# EAGLE design ptFlex (EAGLE 6.6.0)
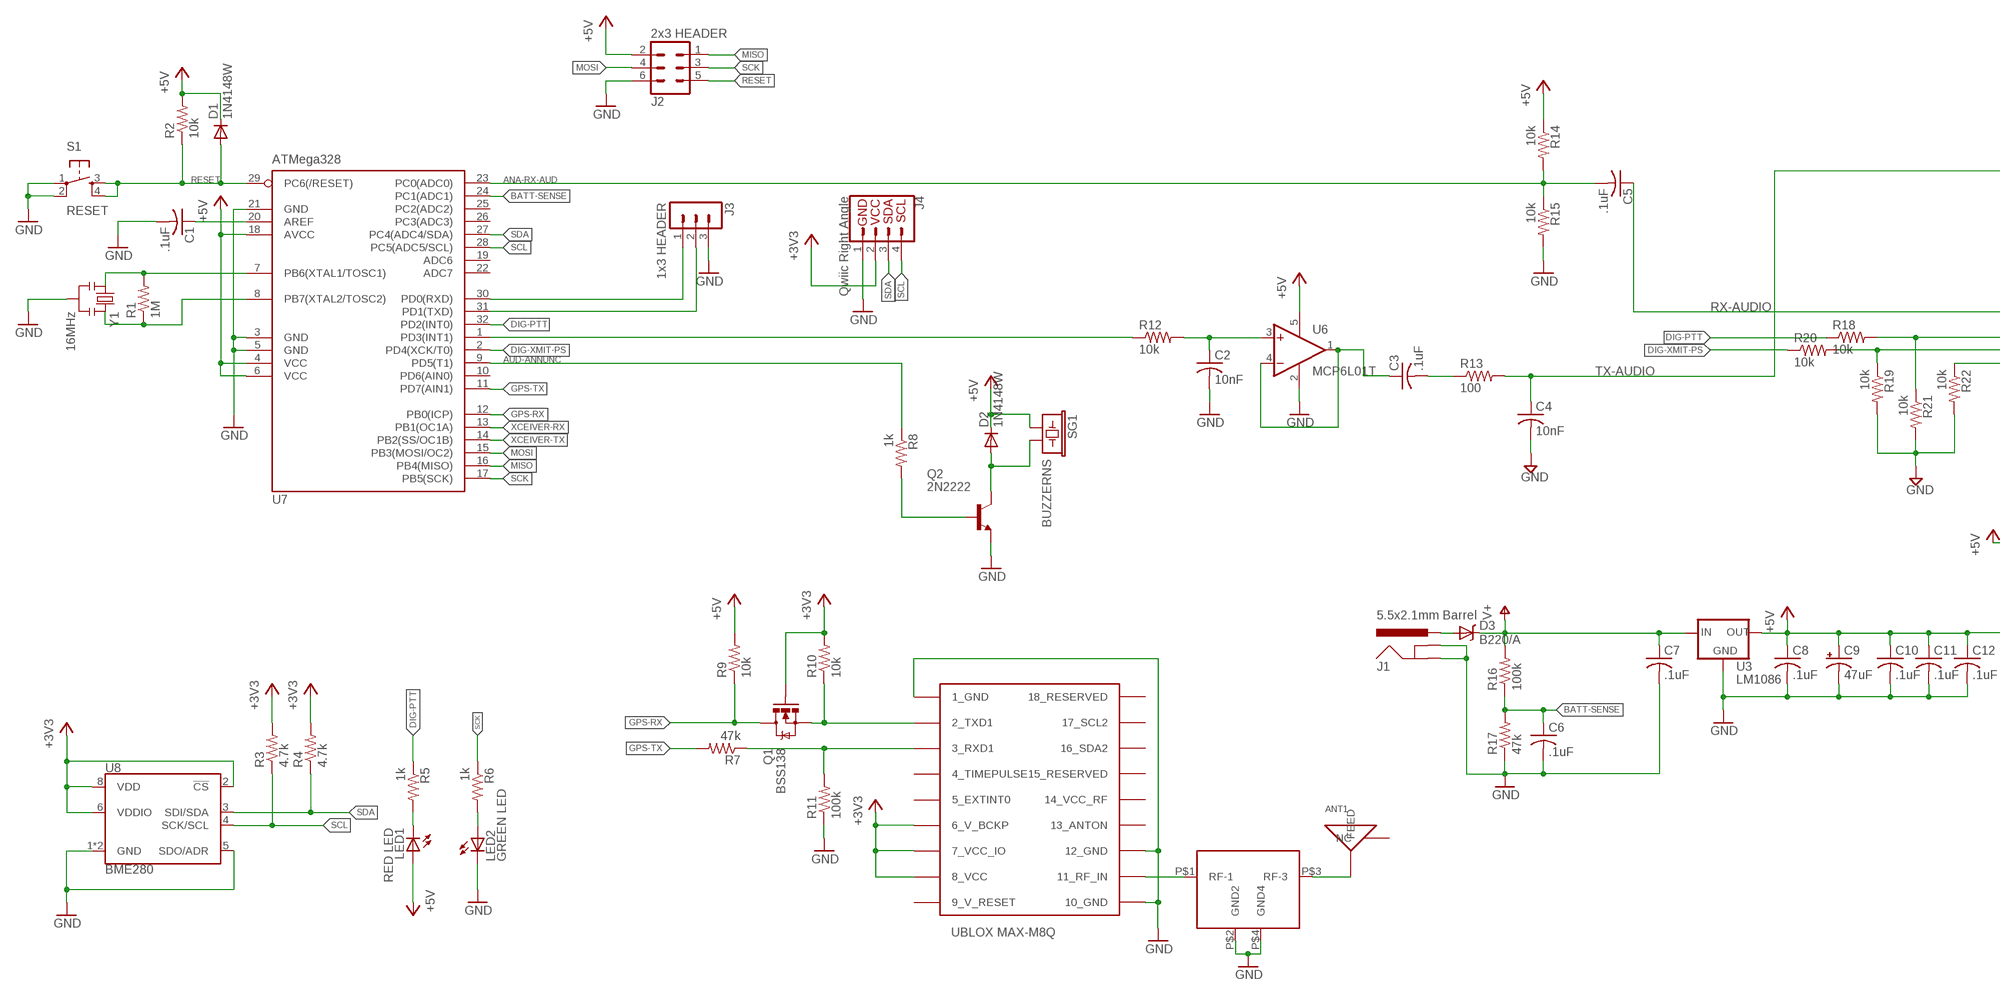
[diagram p0: schematic, sheet 1, part 1 of 2]
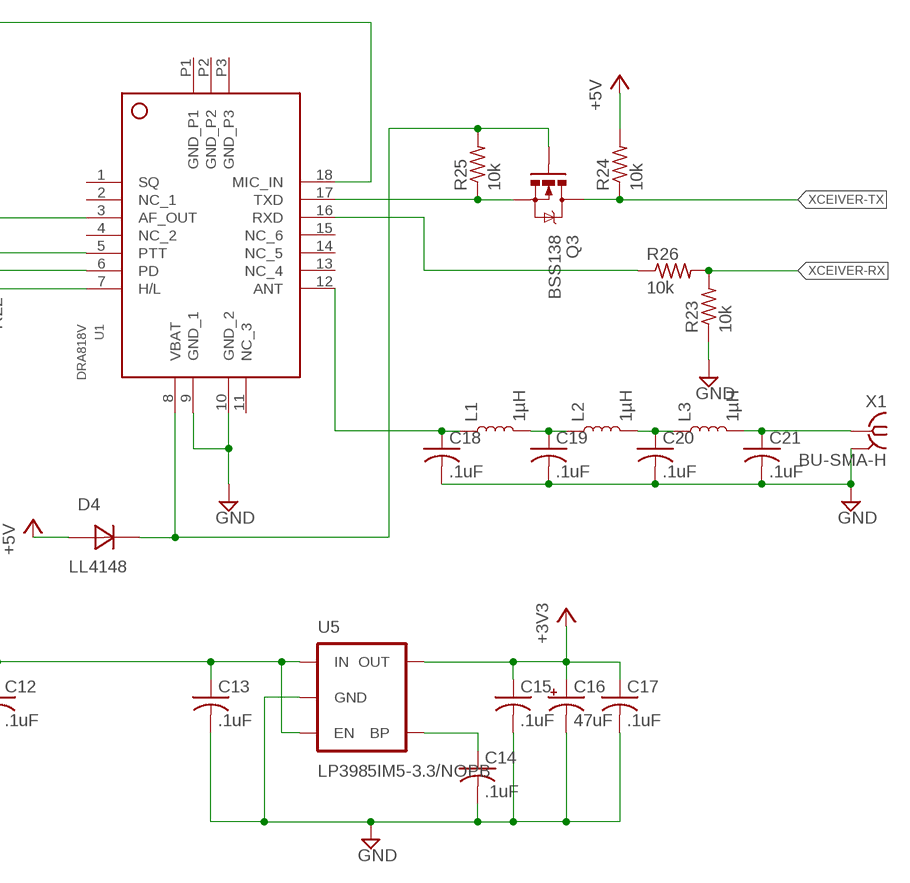
[diagram p1: schematic, sheet 1, part 2 of 2]

## Parts
ANT1  GPS ANTENNA  GPS_ANT_SMDBAR  [1575AT43A40]
C1  .1uF  C-USC0805  [C0805]
C2  10nF  C-USC0805  [C0805]
C3  .1uF  C-USC0805  [C0805]
C4  10nF  C-USC0805  [C0805]
C5  .1uF  C-USC0805  [C0805]
C6  .1uF  C-USC0805  [C0805]
C7  .1uF  C-USC0805  [C0805]
C8  .1uF  C-USC0805  [C0805]
C9  47uF  CPOL-US153CLV-0605  [153CLV-0605]
C10  .1uF  C-USC0805  [C0805]
C11  .1uF  C-USC0805  [C0805]
C12  .1uF  C-USC0805  [C0805]
C13  .1uF  C-USC0805  [C0805]
C14  .1uF  C-USC0805  [C0805]
C15  .1uF  C-USC0805  [C0805]
C16  47uF  CPOL-US153CLV-0605  [153CLV-0605]
C17  .1uF  C-USC0805  [C0805]
C18  .1uF  C-USC0805  [C0805]
C19  .1uF  C-USC0805  [C0805]
C20  .1uF  C-USC0805  [C0805]
C21  .1uF  C-USC0805  [C0805]
D1  1N4148W  DIODE-SOD123  [SOD123]
D2  1N4148W  DIODE-SOD123  [SOD123]
D3  B220/A  B340A  [SMA-DIODE]
D4  LL4148  [SOD-80]
F1  MURATA-GPS-FILTER  [MURATA-GPS-FILTER]
J1  5.5x2.1mm Barrel  POWER_JACKSMD  [POWER_JACK_SMD]
J2  2x3 HEADER  MA03-2  [MA03-2]
J3  1x3 HEADER  MA03-1  [MA03-1]
J4  Qwiic Right Angle  I2C_STANDARDQWIIC  [1X04_1MM_RA]
L1  1µH  INDUCTOR  [L0805]
L2  1µH  INDUCTOR  [L0805]
L3  1µH  INDUCTOR  [L0805]
LED1  RED LED  LEDCHIPLED_1206  [CHIPLED_1206]
LED2  GREEN LED  LEDCHIPLED_1206  [CHIPLED_1206]
Q1  BSS138  MOSFET-NCHANNELBSS138  [SOT23]
Q2  2N2222  BC817-16LT1SMD  [SOT23-BEC]
Q3  BSS138  MOSFET-NCHANNELBSS138  [SOT23]
R1  1M  R-US_R0805  [R0805]
R2  10k  R-US_R0805  [R0805]
R3  4.7k  R-US_R0805  [R0805]
R4  4.7k  R-US_R0805  [R0805]
R5  1k  R-US_R0805  [R0805]
R6  1k  R-US_R0805  [R0805]
R7  47k  R-US_R0805  [R0805]
R8  1k  R-US_R0805  [R0805]
R9  10k  R-US_R0805  [R0805]
R10  10k  R-US_R0805  [R0805]
R11  100k  R-US_R0805  [R0805]
R12  10k  R-US_R0805  [R0805]
R13  100  R-US_R0805  [R0805]
R14  10k  R-US_R0805  [R0805]
R15  10k  R-US_R0805  [R0805]
R16  100k  R-US_R0805  [R0805]
R17  47k  R-US_R0805  [R0805]
R18  10k  R-US_R0805  [R0805]
R19  10k  R-US_R0805  [R0805]
R20  10k  R-US_R0805  [R0805]
R21  10k  R-US_R0805  [R0805]
R22  10k  R-US_R0805  [R0805]
R23  10k  R-US_R0805  [R0805]
R24  10k  R-US_R0805  [R0805]
R25  10k  R-US_R0805  [R0805]
R26  10k  R-US_R0805  [R0805]
S1  RESET  TAC_SWITCHSMD  [TACTILE_SWITCH_SMD]
SG1  BUZZERNS  [BUZZER-12MM-NS]
U1  DRA818V  [SMD_DRA818]
U2  UBLOX_MAX  [UBLOX_MAX]
U3  LM1086  LM1086TO263  [TO263]
U5  LP3985IM5-3.3/NOPB  V_REG_LDOSMD  [SOT23-5]
U6  MCP6L01T  OPA725DBV  [SOT23-5]
U7  ATMega328  MEGA8-AI  [TQFP32-08]
U8  BME280  [LGA-8-2.5X2.5]
X1  BU-SMA-H  [BU-SMA-H]
Y1  16MHz  RESONATOR16MHZ  [RESONATOR-SMD]

## Nets
+3V3: C15.1 C16.+ C17.1 J4.2 Q1.1(G) R3.2 R4.2 R10.2 U2.6_V_BCKP U2.7_VCC_IO U2.8_VCC U5.5(OUT) U8.2(!CS) U8.6(VDDIO) U8.8(VDD)
+5V [Power]: C8.1 C9.+ C10.1 C11.1 C12.1 C13.1 D1.C D2.C D4.ANODE J2.2 LED1.A R2.2 R9.2 R14.1 R24.2 SG1.+ U3.2(OUT) U5.1(IN) U5.3(EN) U6.5(V+) U7.4(VCC) U7.6(VCC) U7.18(AVCC)
ANA-RX-AUD: C5.2 R14.2 R15.1 U7.23(PC0(ADC0))
AUD-ANNUNC: R8.1 U7.9(PD5(T1))
BATT-SENSE: C6.1 R16.1 R17.2 U7.24(PC1(ADC1))
DIG-PTT: R5.1 R18.1 U7.32(PD2(INT0))
DIG-XMIT-PS: R20.1 U7.2(PD4(XCK/T0))
GND [Power]: C1.2 C2.2 C4.2 C6.2 C7.2 C8.2 C9.- C10.2 C11.2 C12.2 C13.2 C14.2 C15.2 C16.- C17.2 C18.2 C19.2 C20.2 C21.2 F1.P$2(GND2) F1.P$4(GND4) J1.GND(GNDBREAK) J1.P$4(GND) J2.6 J3.3 J4.1 LED2.C Q2.E R11.1 R15.2 R17.1 R19.2 R21.2 R22.2 R23.1 S1.1 S1.2 U1.9(GND_1) U1.10(GND_2) U2.1_GND U2.10_GND U2.12_GND U3.1(GND) U5.2(GND) U6.2(V-) U7.3(GND) U7.5(GND) U7.21(GND) U8.1(GND) U8.5(SDO/ADR) U8.7(GND) X1.2 X1.3 X1.4 X1.5 Y1.2
GPS-RX: Q1.3(D) R9.1 U7.12(PB0(ICP))
GPS-TX: R7.2 U7.11(PD7(AIN1))
MISO: J2.1 U7.16(PB4(MISO))
MOSI: J2.4 U7.15(PB3(MOSI/OC2))
N$1: C2.1 R12.2 U6.3(+IN)
N$2: F1.P$1(RF-1) U2.11_RF_IN
N$3: ANT1.FEED F1.P$3(RF-3)
N$4: C20.1 L2.2 L3.1
N$5: C19.1 L1.2 L2.1
N$6: C18.1 L1.1 U1.12(ANT)
N$7: C21.1 L3.2 X1.1
N$8: D3.A J1.VIN0(PWR)
N$9: D2.A Q2.C SG1.-
N$10: C4.1 R13.2 U1.18(MIC_IN)
N$11: C3.1 U6.1(OUT) U6.4(-IN)
N$12: D4.CATHODE Q3.1(G) R25.2 U1.8(VBAT)
N$13: R12.1 U7.1(PD3(INT1))
N$14: R18.2 R21.1 U1.5(PTT)
N$15: Q1.2(S) R10.1 U2.2_TXD1
N$16: R19.1 R20.2 U1.6(PD)
N$17: R1.1 U7.8(PB7(XTAL2/TOSC2)) Y1.3
N$18: R7.1 R11.2 U2.3_RXD1
N$19: R22.1 U1.7(H/L)
N$20: Q3.2(S) R25.1 U1.17(TXD)
N$21: LED1.C R5.2
N$25: LED2.A R6.2
N$27: Q2.B R8.2
N$28: R26.1 U1.16(RXD)
N$59: C1.1 U7.20(AREF)
N$60: C14.1 U5.4(BP)
N$64: R1.2 U7.7(PB6(XTAL1/TOSC1)) Y1.1
RESET: D1.A J2.5 R2.1 S1.3 S1.4 U7.29(PC6(/RESET))
RX-AUDIO: C5.1 U1.3(AF_OUT)
RXD: J3.1 U7.30(PD0(RXD))
SCK: J2.3 R6.1 U7.17(PB5(SCK))
SCL: J4.4 R3.1 U7.28(PC5(ADC5/SCL)) U8.4(SCK/SCL)
SDA: J4.3 R4.1 U7.27(PC4(ADC4/SDA)) U8.3(SDI/SDA)
TX-AUDIO: C3.2 R13.1
TXD: J3.2 U7.31(PD1(TXD))
V+ [Power]: C7.1 D3.C R16.2 U3.3(IN)
XCEIVER-RX: R23.2 R26.2 U7.13(PB1(OC1A))
XCEIVER-TX: Q3.3(D) R24.1 U7.14(PB2(SS/OC1B))
Unconnected: ANT1.NC U1.1(SQ) U1.2(NC_1) U1.4(NC_2) U1.11(NC_3) U1.13(NC_4) U1.14(NC_5) U1.15(NC_6) U1.P1(GND_P1) U1.P2(GND_P2) U1.P3(GND_P3) U2.4_TIMEPULSE U2.5_EXTINT0 U2.13_ANTON U2.14_VCC_RF U2.15_RESERVED U2.16_SDA2 U2.17_SCL2 U2.18_RESERVED U7.10(PD6(AIN0)) U7.19(ADC6) U7.22(ADC7) U7.25(PC2(ADC2)) U7.26(PC3(ADC3))

## Power pins joined to a net without a drawn wire
9_V_RESET: U2.9_V_RESET

## Library data of the parts
ANT1 = Parts:GPS_ANT_SMDBAR: 1.575 GHz GPS Antenna Johanson Technology http://www.digikey.com/product-detail/en/1575AT43A0040E/712-1003-1-ND/1560832; DIGIKEY: 712-1003-1-ND
C1 C3 C5-C8 C10-C15 C17-C21 = resistor:C-US: CAPACITOR, American symbol; DIGIKEY: 311-1361-1-ND
C2 C4 = resistor:C-US: CAPACITOR, American symbol; DIGIKEY: 399-1158-1-ND
C9 C16 = resistor:CPOL-US: POLARIZED CAPACITOR, American symbol; DIGIKEY: PCE3842CT-ND
D1 D2 = custom-ds:DIODE-: DIODE; DIGIKEY: 1N4148W-FDICT-ND
D3 = SparkFun-DiscreteSemi:B340A: Schottky Diode 3A-40V; DIGIKEY: 641-1258-1-ND; PROD_ID: DIO-09886; VALUE: BA340A
D4 = custom-ds:LL4148: General purpose LL1448 Diode in the SOD-80 (glass tube) form factor.
F1 = custom-ds:MURATA-GPS-FILTER; DIGIKEY: 583-1198-1-ND
J1 = SparkFun-Connectors:POWER_JACK: Power Jack Connector This is the standard 5.5mm barrel jack for power. The PTH is the most common, proven, reliable, footprint. The Slot footprint only works if the mill layer is transmitted to the PCB fab house so be warned. Here are the connectors we sell at SparkFun: DC Barrel Power Jack/Connector <https://www.sparkfun.com/products/119> (PRT-00119) DC Barrel Power Jack/Connector (SMD) <https://www.sparkfun.com/products/12748> (PRT-12748) DC Barrel Jack Adapter - Breadboard Compatible <https://www.sparkfun.com/products/10811> (PRT-10811) It is used on this SparkFun product (and many, many others): SparkFun RedBoard - Programmed with Arduino <https://www.sparkfun.com/products/12757> (DEV-12757) Also, if you need a mating power supply or connector, please check these out: Wall Adapter Power Supply - 9VDC 650mA <https://www.sparkfun.com/products/298> (TOL-00298) DC Barrel Jack Adapter - Male <https://www.sparkfun.com/products/10287> (PRT-10287); DIGIKEY: CP-002AHPJCT-ND; PROD_ID: CONN-08106; SF_ID: PRT-12748
J2 = con-lstb:MA03-2: PIN HEADER; DIGIKEY: 952-2121-ND; OC_FARNELL: unknown; OC_NEWARK: unknown
J3 = con-lstb:MA03-1: PIN HEADER; DIGIKEY: 952-2264-ND; OC_FARNELL: unknown; OC_NEWARK: unknown
J4 = SparkFun-Connectors:I2C_STANDARD: SparkFun I2C Standard Pinout Header SparkFun has standardized on a pinout for all I2C based sensor breakouts. This pinout allows I2C boards to be plugged directly into the headers on Arduino Uno compatible boards, and to be daisy chained easily. Example SparkFun Products: SparkFun Atmospheric Sensor Breakout - BME280 <https://www.sparkfun.com/products/13676> SparkFun Altitude/Pressure Sensor Breakout - MPL3115A2 <https://www.sparkfun.com/products/11084> SparkFun TOF Range Finder Sensor - VL6180 <https://www.sparkfun.com/products/12785>; DIGIKEY: 455-1804-1-ND; PROD_ID: CONN-13694
L1-L3 = custom-ds:INDUCTOR: Inductors
LED1 = led:LED: LED OSRAM: - CHIPLED LG R971, LG N971, LY N971, LG Q971, LY Q971, LO R971, LY R971 LH N974, LH R974 LS Q976, LO Q976, LY Q976 LO Q996 - Hyper CHIPLED LW Q18S LB Q993, LB Q99A, LB R99A - SideLED LS A670, LO A670, LY A670, LG A670, LP A670 LB A673, LV A673, LT A673, LW A673 LH A674 LY A675 LS A676, LA A676, LO A676, LY A676, LW A676 LS A679, LY A679, LG A679 - Hyper Micro SIDELED® LS Y876, LA Y876, LO Y876, LY Y876 LT Y87S - SmartLED LW L88C, LW L88S LB L89C, LB L89S, LG L890 LS L89K, LO L89K, LY L89K LS L896, LA L896, LO L896, LY L896 - TOPLED LS T670, LO T670, LY T670, LG T670, LP T670 LSG T670, LSP T670, LSY T670, LOP T670, LYG T670 LG T671, LOG T671, LSG T671 LB T673, LV T673, LT T673, LW T673 LH T674 LS T676, LA T676, LO T676, LY T676, LB T676, LH T676, LSB T676, LW T676 LB T67C, LV T67C, LT T67C, LS T67K, LO T67K, LY T67K, LW E67C LS E67B, LA E67B, LO E67B, LY E67B, LB E67C, LV E67C, LT E67C LW T67C LS T679, LY T679, LG T679 LS T770, LO T770, LY T770, LG T770, LP T770 LB T773, LV T773, LT T773, LW T773 LH T774 LS E675, LA E675, LY E675, LS T675 LS T776, LA T776, LO T776, LY T776, LB T776 LHGB T686 LT T68C, LB T68C - Hyper Mini TOPLED® LB M676 - Mini TOPLED Santana® LG M470 LS M47K, LO M47K, LY M47K Source: http://www.osram.convergy.de LUXEON: - LUMILED® LXK2-PW12-R00, LXK2-PW12-S00, LXK2-PW14-U00, LXK2-PW14-V00 LXK2-PM12-R00, LXK2-PM12-S00, LXK2-PM14-U00 LXK2-PE12-Q00, LXK2-PE12-R00, LXK2-PE12-S00, LXK2-PE14-T00, LXK2-PE14-U00 LXK2-PB12-K00, LXK2-PB12-L00, LXK2-PB12-M00, LXK2-PB14-N00, LXK2-PB14-P00, LXK2-PB14-Q00 LXK2-PR12-L00, LXK2-PR12-M00, LXK2-PR14-Q00, LXK2-PR14-R00 LXK2-PD12-Q00, LXK2-PD12-R00, LXK2-PD12-S00 LXK2-PH12-R00, LXK2-PH12-S00 LXK2-PL12-P00, LXK2-PL12-Q00, LXK2-PL12-R00 Source: www.luxeon.com KINGBRIGHT: KA-3528ASYC Source: www.kingbright.com; DIGIKEY: 160-1405-1-ND
LED2 = led:LED: LED OSRAM: - CHIPLED LG R971, LG N971, LY N971, LG Q971, LY Q971, LO R971, LY R971 LH N974, LH R974 LS Q976, LO Q976, LY Q976 LO Q996 - Hyper CHIPLED LW Q18S LB Q993, LB Q99A, LB R99A - SideLED LS A670, LO A670, LY A670, LG A670, LP A670 LB A673, LV A673, LT A673, LW A673 LH A674 LY A675 LS A676, LA A676, LO A676, LY A676, LW A676 LS A679, LY A679, LG A679 - Hyper Micro SIDELED® LS Y876, LA Y876, LO Y876, LY Y876 LT Y87S - SmartLED LW L88C, LW L88S LB L89C, LB L89S, LG L890 LS L89K, LO L89K, LY L89K LS L896, LA L896, LO L896, LY L896 - TOPLED LS T670, LO T670, LY T670, LG T670, LP T670 LSG T670, LSP T670, LSY T670, LOP T670, LYG T670 LG T671, LOG T671, LSG T671 LB T673, LV T673, LT T673, LW T673 LH T674 LS T676, LA T676, LO T676, LY T676, LB T676, LH T676, LSB T676, LW T676 LB T67C, LV T67C, LT T67C, LS T67K, LO T67K, LY T67K, LW E67C LS E67B, LA E67B, LO E67B, LY E67B, LB E67C, LV E67C, LT E67C LW T67C LS T679, LY T679, LG T679 LS T770, LO T770, LY T770, LG T770, LP T770 LB T773, LV T773, LT T773, LW T773 LH T774 LS E675, LA E675, LY E675, LS T675 LS T776, LA T776, LO T776, LY T776, LB T776 LHGB T686 LT T68C, LB T68C - Hyper Mini TOPLED® LB M676 - Mini TOPLED Santana® LG M470 LS M47K, LO M47K, LY M47K Source: http://www.osram.convergy.de LUXEON: - LUMILED® LXK2-PW12-R00, LXK2-PW12-S00, LXK2-PW14-U00, LXK2-PW14-V00 LXK2-PM12-R00, LXK2-PM12-S00, LXK2-PM14-U00 LXK2-PE12-Q00, LXK2-PE12-R00, LXK2-PE12-S00, LXK2-PE14-T00, LXK2-PE14-U00 LXK2-PB12-K00, LXK2-PB12-L00, LXK2-PB12-M00, LXK2-PB14-N00, LXK2-PB14-P00, LXK2-PB14-Q00 LXK2-PR12-L00, LXK2-PR12-M00, LXK2-PR14-Q00, LXK2-PR14-R00 LXK2-PD12-Q00, LXK2-PD12-R00, LXK2-PD12-S00 LXK2-PH12-R00, LXK2-PH12-S00 LXK2-PL12-P00, LXK2-PL12-Q00, LXK2-PL12-R00 Source: www.luxeon.com KINGBRIGHT: KA-3528ASYC Source: www.kingbright.com; DIGIKEY: 160-1169-1-ND
Q1 Q3 = SparkFun-DiscreteSemi:MOSFET-NCHANNEL: Common NMOSFET Parts MFG P/N Store ID Prod ID FDD8780 TRANS-09984 SI7820DN TRANS-11055 FDS6630A IC-08089 2N7002PW TRANS-11151 FQP30N06L COM-10213 TRANS-10060 BSS123LT1G TRANS-08345 BSS138 TRANS-00830 BS170 2N7000; DIGIKEY: BSS138KCT-ND; PROD_ID: TRANS-00830
Q2 = transistor-npn:BC817*: NPN Transistor; DIGIKEY: MMBT2222AFSCT-ND
R1 = resistor:R-US_: RESISTOR, American symbol; DIGIKEY: 311-1.0MARCT-ND
R2 R9 R10 R12 R14 R15 R18-R26 = resistor:R-US_: RESISTOR, American symbol; DIGIKEY: 311-10.0KCRCT-ND
R3 R4 = resistor:R-US_: RESISTOR, American symbol; DIGIKEY: 311-4.7KARCT-ND
R5 R6 R8 = resistor:R-US_: RESISTOR, American symbol; DIGIKEY: 311-1.0KARCT-ND
R7 R17 = resistor:R-US_: RESISTOR, American symbol; DIGIKEY: 311-47.0KCRCT-ND
R11 R16 = resistor:R-US_: RESISTOR, American symbol; DIGIKEY: 311-100KCRCT-ND
R13 = resistor:R-US_: RESISTOR, American symbol; DIGIKEY: 311-100ARCT-ND
S1 = SparkFun-Electromechanical:TAC_SWITCH: Momentary Switch Button commonly used for reset or general input. Spark Fun Electronics SKU : COM-00097 SMT- SWCH-08247; DIGIKEY: CKN9104CT-ND; PROD_ID: SWCH-08247
SG1 = SparkFun-Electromechanical:BUZZER: Buzzer 12mm Spark Fun Electronics SKU : Comp-Buzzer; DIGIKEY: 102-1155-ND
U1 = custom-ds:DRA818V: DRA818V is a compact wireless voice transceiver from Dorji. http://www.dorji.com/pro/Modules/Audio_voice_transceiver.html
U2 = Ava:UBLOX_MAX: UBLOX MAX; ALT-PART: UBLOX MAX-M8Q; DIGIKEY: 672-1003-1-ND
U3 = v-reg-2:LM1086; DIGIKEY: LM1086ISX-5.0/NOPBCT-ND
U5 = SparkFun-PowerIC:V_REG_LDO: Voltage Regulator LDO Standard 150mA LDO voltage regulator in SOT-23 layout. Micrel part MIC5205. BP (by-pass) pin is used to lower output noise with 470pF cap.; DIGIKEY: LP3985IM5-3.3/NOPBCT-ND
U6 = linear:OPA725: Very Low Noise, High-Speed, 12V CMOS Operational Amplifier Source: http://focus.ti.com/lit/ds/symlink/opa725.pdf; DIGIKEY: MCP6L01T-E/OTCT-ND
U7 = atmel:MEGA8: MICROCONTROLLER 8 Kbytes FLASH, 1 kbytes SRAM, 512 bytes EEPROM, USART, 6-channel 10 bit ADC, 2-channel 8 bit ADC Pin compatible with Atmega48, ATMega88, ATMega168 Source: avr.lbr; DIGIKEY: ATMEGA328P-AU-ND; MPN: ATMEGA8-16AU; OC_FARNELL: 9171371; OC_NEWARK: 73M8863
U8 = SparkFun-Sensors:BME280: Bosch BME280 – Combined Humidity and Pressure Sensor The BME280 is as combined digital humidity, pressure and temperature sensor based on proven sensing principles. The sensor module is housed in an extremely compact metal-lid LGA package with a footprint of only 2.5×2.5mm² with a height of 0.93mm. Its small dimensions and its low power consumption allow the implementation in battery driven devices such as handsets, GPS modules or watches. Datasheet <https://cdn.sparkfun.com/assets/learn_tutorials/4/1/9/BST-BME280_DS001-10.pdf> SparkFun Products SparkFun Atmospheric Sensor Breakout - BME280 <https://www.sparkfun.com/products/13676> (SEN-13676); DIGIKEY: 828-1063-1-ND; PROD_ID: IC-13090
X1 = con-coax:BU-SMA-H: FEMALE SMA CONNECTOR Radiall; DIGIKEY: CONSMA001-ND; OC_FARNELL: unknown; OC_NEWARK: unknown
Y1 = SparkFun-FreqCtrl:RESONATOR: Resonator Small SMD resonator. Used, eg, on the Arduino Pro/ Pro Mini boards. 8MHz- XTAL-08895 16MHz- XTAL-08900; DIGIKEY: 478-5420-1-ND; PROD_ID: XTAL-08900

## Net classes
1 Power: width 0.127 mm, clearance 0.025 mm

## Board
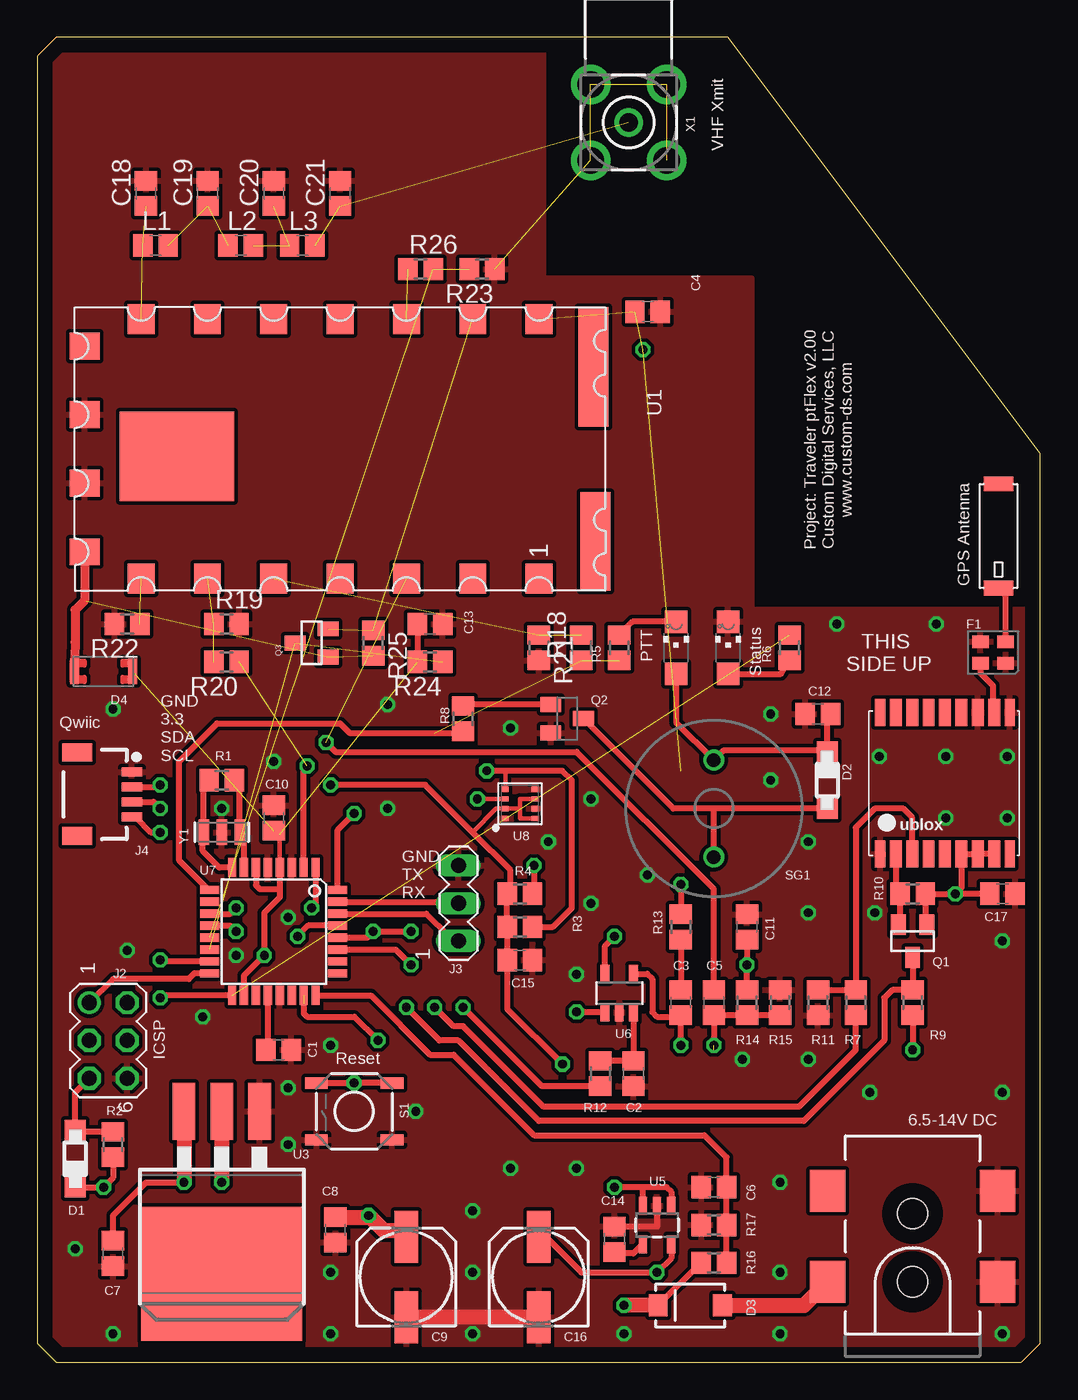
[diagram p2: board, top side]
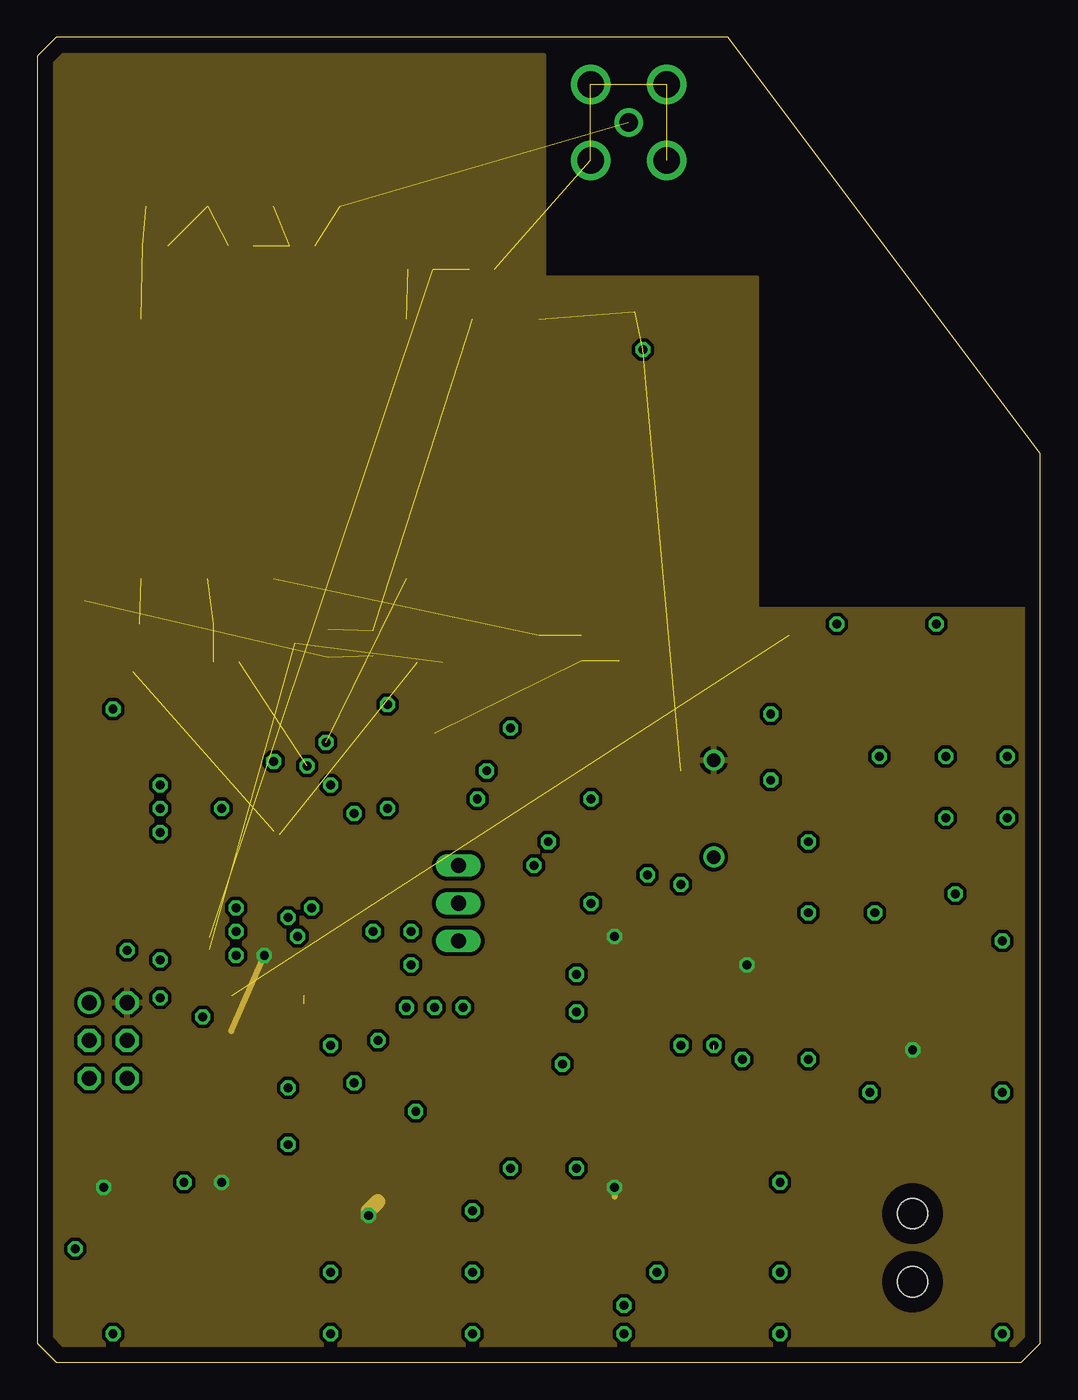
[diagram p3: board, inner layer +5]
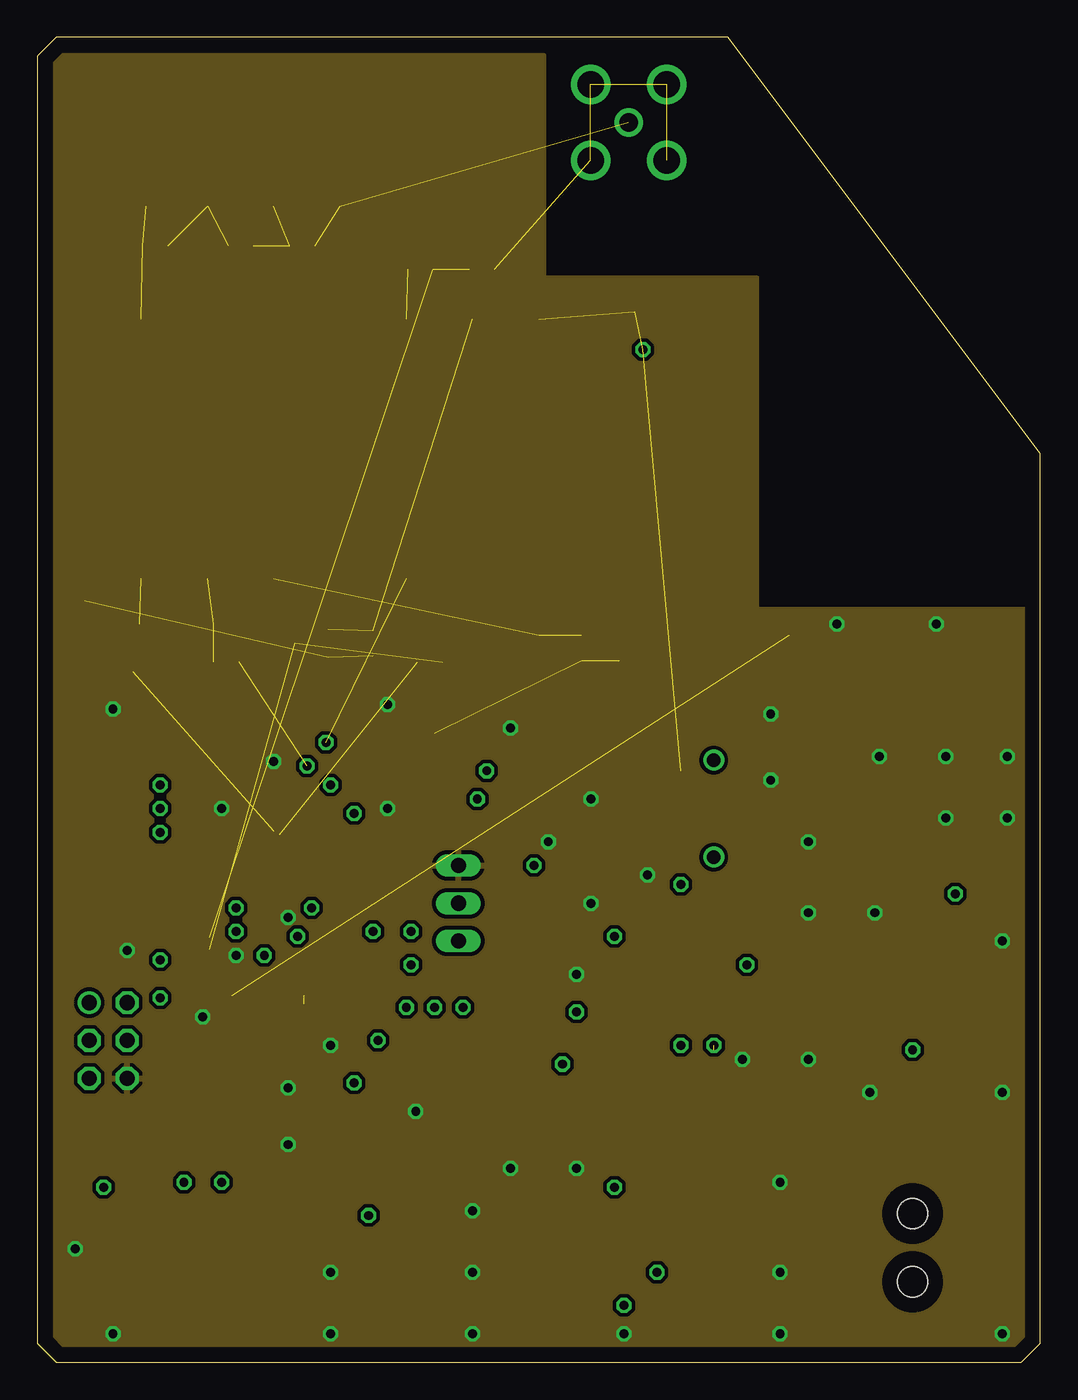
[diagram p4: board, inner layer Gnd]
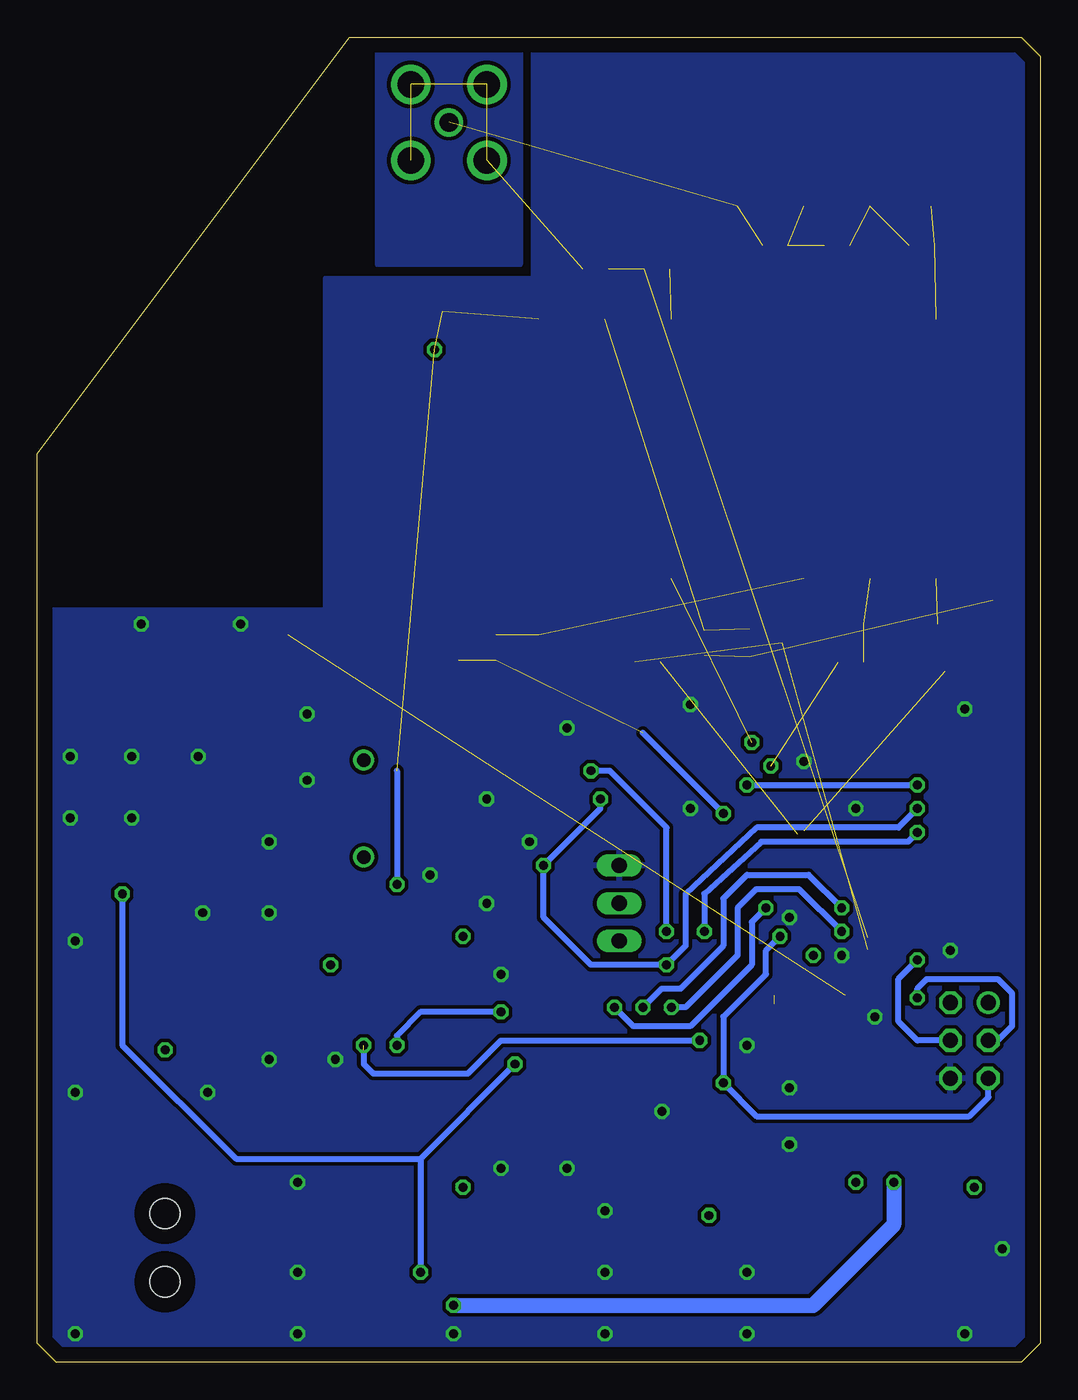
[diagram p5: board, bottom side, seen from below]

Size 67.31 x 88.9 mm. Coordinates in mm from the lower left corner, seen from the top.
Outline: 67.31,1.27 66.04,0 1.27,0 0,1.27 0,87.63 1.27,88.9 46.35,88.9 67.31,60.96 67.31,1.27
Copper layers (1+2*15+16): Top 0.035mm / dielectric 1.5mm / +5 0.035mm / dielectric 0.15mm / Gnd 0.035mm / dielectric 0.2mm / Bottom 0.035mm
Design rules "default *": minimum track width 10mil, minimum drill 23mil, track to track 10mil, track to pad 10mil, pad to pad 8mil, via to via 10mil, smd to smd 8mil, copper to edge 40mil, drill to drill 8mil, minimum pad ring 10mil, minimum via ring 8mil, stop-mask expansion 4mil, vias tented up to drill 0mil, thermal gap 10mil

### Footprints (pad centres in the part's own frame; a part is rotated, then mirrored left to right if it is on the bottom)
1575AT43A40 = smd 1 x 2: FEED 0.5,-1; NC 7.5,-1
C0805 = smd 1.3 x 1.5: 1 -0.85,0; 2 0.85,0
153CLV-0605 = smd 3.5 x 1.6: + 2.7,0; - -2.7,0
SOD123 = smd 1.4 x 1.4: A 1.9,0; C -1.9,0
SMA-DIODE = smd 1.27 x 1.47: A -2.15,0; C 2.15,0
SOD-80 = smd 0.6 x 1.7: ANODE -1.95,0; CATHODE 1.95,0
MURATA-GPS-FILTER = smd 1.1 x 0.85: P$1 -0.85,-0.725; P$2 0.85,-0.725; P$3 0.85,0.725; P$4 -0.85,0.725
POWER_JACK_SMD = smd 2.8 x 2.4: GND 0,-5.7; P$4 6.1,-5.7; VIN0 0,5.7; VIN1 6.1,5.7 | hole 2.032: 0,0; 4.572,0
MA03-2 = drill 1.016: 1 -2.54,-1.27 | drill 1.016 octagon: 2 -2.54,1.27; 3 0,-1.27; 4 0,1.27; 5 2.54,-1.27; 6 2.54,1.27
MA03-1 = drill 1.016 long: 1 -2.54,0; 2 0,0; 3 2.54,0
1X04_1MM_RA = smd 0.6 x 1.35: 1 -1.5,0; 2 -0.5,0; 3 0.5,0; 4 1.5,0 | smd 1.2 x 2: NC1 2.8,-3.675; NC2 -2.8,-3.675
L0805 = smd 1.3 x 1.5: 1 -0.85,0; 2 0.85,0
CHIPLED_1206 = smd 1.5 x 1.5: A 0,-1.75; C 0,1.75
SOT23 = smd 1 x 1.4: 1 -0.95,-1.1; 2 0.95,-1.1; 3 0,1.1
SOT23-BEC = smd 1 x 1.4: B -0.95,-1.1; C 0,1.1; E 0.95,-1.1
R0805 = smd 1.3 x 1.5: 1 -0.85,0; 2 0.85,0
TACTILE_SWITCH_SMD = smd 1.524 x 0.762: 1 -2.54,1.905; 2 2.54,1.905; 3 -2.54,-1.905; 4 2.54,-1.905
BUZZER-12MM-NS = drill 0.9: + 3.25,0; - -3.25,0
SMD_DRA818 = smd 1.8 x 2: 1 -13.35,8.7; 2 -8.9,8.7; 3 -4.45,8.7; 4 0,8.7; 5 4.45,8.7; 6 8.9,8.7; 7 13.35,8.7; 12 13.35,-8.7; 13 8.9,-8.7; 14 4.45,-8.7; 15 0,-8.7; 16 -4.45,-8.7; 17 -8.9,-8.7; 18 -13.35,-8.7 | smd 2 x 1.8: 8 17.145,6.9; 9 17.145,2.3; 10 17.145,-2.3; 11 17.145,-6.9 | smd 7.7 x 6: P1 10.95,0.5 | smd 2 x 6.6: P2 -17.145,6.2 | smd 2 x 8: P3 -17,-5.5
UBLOX_MAX = smd 1.8 x 0.7: 1_GND 4.95,-4.4; 9_V_RESET 4.95,4.3; 10_GND -4.55,4.3; 18_RESERVED -4.55,-4.4 | smd 1.8 x 0.8: 2_TXD1 4.95,-3.35; 3_RXD1 4.95,-2.25; 4_TIMEPULSE 4.95,-1.15; 5_EXTINT0 4.95,-0.05; 6_V_BCKP 4.95,1.05; 7_VCC_IO 4.95,2.15; 8_VCC 4.95,3.25; 11_RF_IN -4.55,3.25; 12_GND -4.55,2.15; 13_ANTON -4.55,1.05; 14_VCC_RF -4.55,-0.05; 15_RESERVED -4.55,-1.15; 16_SDA2 -4.55,-2.25; 17_SCL2 -4.55,-3.35
TO263 = smd 1.524 x 3.81: 1 -2.54,-8.255; 2 0,-8.255; 3 2.54,-8.255 | smd 10.8 x 9: 4 0,2.635
SOT23-5 = smd 0.55 x 1.2: 1 -0.95,-1.3; 2 0,-1.3; 3 0.95,-1.3; 4 0.95,1.3; 5 -0.95,1.3
SOT23-5' = smd 0.6 x 1.2: 1 -0.95,-1.306; 2 0,-1.306; 3 0.95,-1.306; 4 0.95,1.306; 5 -0.95,1.306
TQFP32-08 = smd 1.27 x 0.559: 1 -4.293,2.8; 2 -4.293,2; 3 -4.293,1.2; 4 -4.293,0.4; 5 -4.293,-0.4; 6 -4.293,-1.2; 7 -4.293,-2; 8 -4.293,-2.8; 17 4.293,-2.8; 18 4.293,-2; 19 4.293,-1.2; 20 4.293,-0.4; 21 4.293,0.4; 22 4.293,1.2; 23 4.293,2; 24 4.293,2.8 | smd 0.559 x 1.27: 9 -2.8,-4.293; 10 -2,-4.293; 11 -1.2,-4.293; 12 -0.4,-4.293; 13 0.4,-4.293; 14 1.2,-4.293; 15 2,-4.293; 16 2.8,-4.293; 25 2.8,4.293; 26 2,4.293; 27 1.2,4.293; 28 0.4,4.293; 29 -0.4,4.293; 30 -1.2,4.293; 31 -2,4.293; 32 -2.8,4.293
LGA-8-2.5X2.5 = smd 0.35 x 0.5: 1 -0.975,1.025; 2 -0.325,1.025; 3 0.325,1.025; 4 0.975,1.025; 5 0.975,-1.025; 6 0.325,-1.025; 7 -0.325,-1.025; 8 -0.975,-1.025
BU-SMA-H = drill 1.27: 1 0,0 | drill 1.778: 2 -2.55,2.55; 3 2.55,2.55; 4 2.55,-2.55; 5 -2.55,-2.55
RESONATOR-SMD = smd 0.7 x 1.7: 1 -1.2,0; 2 0,0; 3 1.2,0

### Placement (x,y rotation side)
ANT1  63.5,51.44 90 top
C1  16.19,20.95 0 top
C2  40.01,19.37 270 top
C3  43.18,24.13 90 top
C4  40.96,70.48 0 top
C5  45.4,24.13 270 top
C6  45.4,11.75 180 top
C7  5.08,7.3 270 top
C8  20,8.89 270 top
C9  24.77,5.71 90 top
C10  15.88,36.51 90 top
C11  47.62,29.21 90 top
C12  52.39,43.5 180 top
C13  26.35,49.53 0 top
C14  38.73,8.26 90 top
C15  32.38,26.99 0 top
C16  33.66,5.71 90 top
C17  64.77,31.43 0 top
C18  7.3,78.42 90 top
C19  11.43,78.42 90 top
C20  15.88,78.42 90 top
C21  20.32,78.42 90 top
D1  2.54,13.65 90 top
D2  53.02,39.05 270 top
D3  43.81,3.81 180 top
D4  4.45,46.35 180 top
F1  64.14,47.62 0 top
J1  58.74,5.4 90 top
J2  4.76,21.59 270 top
J3  28.26,30.8 90 top
J4  6.35,38.1 270 top
L1  7.94,74.93 0 top
L2  13.65,74.93 0 top
L3  17.78,74.93 0 top
LED1  42.86,47.94 0 top
LED2  46.35,47.94 0 top
Q1  58.74,28.26 180 top
Q2  35.56,43.18 270 top
Q3  18.41,48.26 90 top
R1  12.38,39.05 0 top
R2  5.08,14.61 270 top
R3  32.38,29.21 180 top
R4  32.38,31.43 180 top
R5  39.05,47.94 90 top
R6  50.48,47.94 270 top
R7  54.93,24.13 270 top
R8  28.57,43.18 90 top
R9  58.74,24.13 270 top
R10  58.74,31.43 0 top
R11  52.39,24.13 90 top
R12  37.78,19.37 90 top
R13  43.18,29.21 90 top
R14  47.62,24.13 270 top
R15  49.85,24.13 90 top
R16  45.4,6.67 180 top
R17  45.4,9.21 0 top
R18  36.51,47.94 90 top
R19  12.7,49.53 0 top
R20  12.7,46.99 180 top
R21  33.66,47.94 270 top
R22  6.03,49.53 180 top
R23  29.84,73.34 180 top
R24  26.35,46.99 180 top
R25  22.54,48.26 270 top
R26  25.72,73.34 0 top
S1  21.27,16.83 180 top
SG1  45.4,37.15 90 top
U1  20.32,61.28 180 top
U2  60.96,39.05 270 top
U3  12.38,8.57 180 top
U5  41.59,9.21 180 top
U6  MCP6L01T  [SOT23-5']  39.05,24.77 0 top
U7  15.88,28.89 270 top
U8  32.38,37.47 90 top
X1  39.69,83.19 90 top
Y1  12.38,35.56 180 top

### Tracks (layer width: path | path; a pad name or v marks a point on that pad's centre or on a via)
+3V3  (via drill 0.6)
  Top 0.305: 31.75,31.65 R4.2 | U8.6 32.38,37.78 32.38,37.14 | U8.8 32.38,36.49 32.38,37.14 | 32.38,37.14 U8.2 30.79,37.14 29.21,35.56
  Top 0.406: 33.66,8.26 C16.+ 33.81,8.26 34.29,8.26 36.51,6.03 v41.59,6.03 42.54,6.98 U5.5 | U2.8_VCC U2.7_VCC_IO U2.6_V_BCKP 62.01,31.85 v61.59,31.43 | R4.2 R3.2 C15.1 31.54,23.71 v35.24,20 | Q1.1 59.59,29.46 R10.2 v61.59,31.43 | C17.1 v61.59,31.43 | J4.2 8.12,38.6 v8.26,38.73 | 31.75,31.65 31.75,33.02 29.21,35.56 26.04,38.73 v19.68,38.73
  Bottom 0.406: v61.59,31.43 61.59,21.27 53.98,13.65 41.59,13.65 | v35.24,20 41.59,13.65 | 41.59,13.65 v41.59,6.03 | v19.68,38.73 v8.26,38.73
+5V  (via drill 0.6)  (2 unrouted)
  Top 0.305: U7.4 16.27,35.43 C10.1
  Top 0.406: U5.1 42.55,11.43 42.23,11.75 40.64,11.75 | U7.4 16.27,31.75 | 16.27,31.75 16.27,31.2 15.24,30.16 v15.24,27.3 13.88,25.94 U7.18 | U7.6 14.68,32 14.92,31.75 16.27,31.75 | U6.5 38.1,27.94 v38.73,28.57 | R14.1 v47.62,26.67 C11.1 | R9.2 v58.74,20.95 | U5.3 40.64,11.74 40.64,11.75 | C12.1 53.02,43.28 D2.C 52.94,41.03 46.04,41.03 SG1.+ 42.86,42.94 LED1.A | D1.C v4.44,11.75 v4.45,11.75 5.08,12.38 R2.2 | 40.64,11.75 v38.73,11.75 | C13.1 R24.2
  Top 1.016: U3.2 v12.38,12.06 | 24.61,8.57 C9.+ 24.37,8.81 23.26,8.81 v22.23,9.84 22.12,9.74 C8.1
  +5 0.406: v38.73,11.75 38.73,11.11 | v15.24,27.3 13.02,22.23
  +5 1.016: v22.23,9.84 22.23,10.16 22.86,10.79
  Bottom 0.406: SG1.+ 45.33,40.4
  pour +5: 1.59,0.95 65.41,0.95 66.36,1.91 66.36,50.48 48.26,50.48 48.26,72.71 33.97,72.71 33.97,87.63 1.27,87.63 0.95,87.31 0.95,1.59
ANA-RX-AUD  (via drill 0.6)  (2 unrouted)
  Top 0.406: R15.1 R14.2 C5.2 v45.4,21.27 | 17.88,24.04 17.88,23.4 18.1,23.18 21.27,23.18 v22.86,21.59
  Bottom 0.406: 45.4,20.95 45.4,20 44.77,19.37 38.42,19.37 36.2,21.59 v22.86,21.59
AUD-ANNUNC
  Top 0.406: U7.9 11.49,31.69 9.53,33.66 9.53,40.32 12.06,42.86 20.32,42.86 20.95,42.23 28.47,42.23 R8.1
BATT-SENSE
  Top 0.406: U7.24 22.39,24.6 26.35,20.64 27.94,20.64 33.34,15.24 44.77,15.24 46.25,13.76 C6.1 R17.2 R16.1
DIG-PTT  (via drill 0.6)  (2 unrouted)
  Top 0.406: U7.32 20.17,35.73 v21.27,36.83
  Bottom 0.406: v21.27,36.83 26.67,42.23
DIG-XMIT-PS  (via drill 0.6)  (1 unrouted)
  Top 0.406: U7.2 17.88,39.78 v18.1,40.01
GND  (via drill 0.6)  (4 unrouted)
  Top 0.406: C14.2 41.59,9.11 U5.2
  Top 1.016: C16.- 25.37,3.02
  other vias: 13.34,27.3 60.96,40.64 29.21,10.16 65.09,36.51 49.21,43.5 31.75,13.02 23.5,44.13 37.15,30.8 56.2,30.16 64.77,18.1 40.96,32.7 51.75,30.16 31.75,42.55 51.75,34.92 5.08,43.81 49.85,1.91 64.77,1.91 39.37,1.91 29.21,1.91 19.68,1.91 5.08,1.91 19.68,6.03 29.21,6.03 49.85,6.03 12.38,37.15 16.83,29.84 64.77,28.26 6.03,27.62 25.4,16.83 16.83,14.61 19.68,21.27 2.54,7.62 55.88,18.1 51.75,20.32 49.21,39.05 15.88,40.32 23.5,37.15 65.09,40.64 34.29,34.92 56.52,40.64 11.11,23.18 16.83,18.41 36.2,26.04 47.31,20.32 49.85,12.06 36.2,13.02 60.96,36.51 37.15,37.78 53.66,49.53 60.33,49.53
  pour Bottom (isolate 0.254): 0.32,1.59 1.59,0.32 66.04,0.32 66.99,1.27 66.99,50.48 47.94,50.48 47.94,72.71 33.97,72.71 33.97,88.58 1.59,88.58 0.32,87.31
  pour Top (isolate 0.254): 66.99,50.48 47.94,50.48 47.94,72.71 33.97,72.71 33.97,88.58 1.59,88.58 0.32,87.31 0.32,1.59 1.59,0.32 66.04,0.32 66.99,1.27
  pour Gnd: 1.59,0.95 65.41,0.95 66.36,1.91 66.36,50.48 48.26,50.48 48.26,72.71 33.97,72.71 33.97,87.63 1.27,87.63 0.95,87.31 0.95,1.59
GPS-RX  (via drill 0.6)
  Top 0.406: U7.12 12.94,29.29 v13.34,28.89 | Q1.3 R9.1 57.37,24.98 56.83,24.45 56.83,21.59 51.44,16.19 33.66,16.19 28.26,21.59 26.99,21.59 v24.77,23.81
  Bottom 0.406: v13.34,28.89 16.19,31.75 19.05,31.75 20.32,30.48 20.32,27.3 23.81,23.81 v24.77,23.81
GPS-TX  (via drill 0.6)
  Top 0.406: U7.11 12.95,30.09 v13.34,30.48 | R7.2 54.93,20.95 51.12,17.14 33.97,17.14 28.57,22.54 27.94,22.54 v26.67,23.81
  Bottom 0.406: v13.34,30.48 15.56,32.7 19.68,32.7 21.27,31.11 21.27,27.94 24.13,25.08 25.4,25.08 v26.67,23.81
MISO
  Top 0.406: U7.16 10.54,26.09 10.16,25.72 5.08,25.72 J2.1
MOSI  (via drill 0.6)
  Top 0.406: U7.15 8.35,26.89 v8.26,26.99
  Bottom 0.406: J2.4 8.26,21.59 9.53,22.86 9.53,25.72 v8.26,26.99
N$1
  Top 0.406: U6.3 C2.1 R12.2
N$2
  Top 0.406: 64.22,43.62 U2.11_RF_IN 64.14,43.68 64.14,45.4 63.28,46.25 F1.P$1
N$3
  Top 0.406: F1.P$3 64.98,51.45 ANT1.FEED
N$4  (2 unrouted)
N$5  (2 unrouted)
N$6  (2 unrouted)
N$7  (2 unrouted)
N$8
  Top 1.016: D3.A 51.45,3.81 J1.VIN0
N$9
  Top 0.406: 36.66,43.03 Q2.C 42.69,37.15 45.4,37.15 | D2.A 45.4,37.15 | SG1.- 45.4,37.15
N$10  (via drill 0.6)  (3 unrouted)
  Top 0.406: v43.18,32.07 R13.2
  Bottom 0.406: 43.18,39.69 v43.18,32.07
  other vias: 40.64,67.94
N$11  (via drill 0.6)
  Top 0.406: U6.4 40.92,26.07 41.27,25.72 41.27,23.5 41.59,23.18 43.08,23.18 C3.1 v43.18,21.27 | U6.1 36.23,23.46 v36.2,23.5
  Bottom 0.406: v36.2,23.5 41.59,23.5 43.18,21.91 v43.18,21.27
N$12  (2 unrouted)
  Top 0.61: U1.8 3.17,51.12 2.54,50.48 2.54,48.3 D4.CATHODE
N$13  (via drill 0.6)
  Top 0.406: U7.1 18.68,30.74 v18.41,30.48 | R12.1 33.87,18.52 v28.57,23.81
  Bottom 0.406: v18.41,30.48 19.37,29.53 19.37,26.67 23.5,22.54 27.3,22.54 v28.57,23.81
N$14  (2 unrouted)
N$15
  Top 0.406: U2.2_TXD1 57.61,31.71 R10.1 57.89,29.46 Q1.2
N$16  (2 unrouted)
N$17
  Top 0.406: U7.8 12.22,33.19 11.11,34.29 11.11,35.49 Y1.3 11.18,38.7 R1.1
N$18
  Top 0.406: U2.3_RXD1 58.71,36.54 58.1,37.15 56.2,37.15 54.93,35.88 R7.1 R11.2
N$19  (1 unrouted)
N$20  (2 unrouted)
N$21
  Top 0.406: LED1.C 39.95,49.69 R5.2
N$25
  Top 0.406: LED2.A 49.9,46.19 R6.2
N$27
  Top 0.406: Q2.B 28.68,44.13 R8.2
N$28  (1 unrouted)
N$59
  Top 0.406: U7.20 15.47,21.09 C1.1
N$60
  Top 0.406: U5.4 40.61,7.91 40.01,7.3 38.84,7.3 C14.1
N$64
  Top 0.406: U7.7 13.88,35.27 Y1.1 13.58,38.7 R1.2
RESET  (via drill 0.6)
  Top 0.406: S1.4 v21.27,18.73 S1.3 | U7.29 18.18,29.29 v17.46,28.57 | J2.5 2.54,18.1 D1.A 2.64,15.46 R2.1
  Bottom 0.406: J2.5 3.49,17.78 4.76,16.51 19.05,16.51 v21.27,18.73 21.27,23.18 18.41,26.04 18.41,27.62 v17.46,28.57
RFGND
  pour Bottom: 34.92,88.58 34.92,73.66 44.45,73.66 44.45,88.58
RX-AUDIO  (via drill 0.6)  (1 unrouted)
  Top 0.406: C5.1 45.4,31.75 36.2,40.96 20,40.96 v19.37,41.59
RXD
  Top 0.406: U7.30 26.11,30.09 27.62,28.57 27.94,28.57 J3.1
SCK  (via drill 0.6)  (1 unrouted)
  Top 0.406: U7.17 8.41,24.6 v8.26,24.45
  Bottom 0.406: v8.26,24.45 8.26,25.08 7.62,25.72 2.86,25.72 1.91,24.77 1.91,22.54 2.86,21.59 J2.3
SCL  (via drill 0.6)
  Top 0.305: U8.4 31.43,38.51 31.43,39.69
  Top 0.406: J4.4 6.35,36.51 6.67,36.51 7.62,35.56 v8.26,35.56 | v25.08,28.89 v22.54,28.89 22.14,28.49 U7.28 | R3.1 34.61,29.21 35.88,30.48 35.88,39.05 35.24,39.69 31.43,39.69 v30.16,39.69
  Bottom 0.406: v30.16,39.69 28.89,39.69 25.08,35.88 v25.08,28.89 | v8.26,35.56 8.89,34.92 18.73,34.92 22.54,31.43 v22.54,28.89
SDA  (via drill 0.6)
  Top 0.305: U8.3 v29.54,37.79 v29.53,37.78
  Top 0.406: U7.27 24.06,27.69 v25.08,26.67 | J4.3 7.8,37.6 v8.26,37.15 | v33.34,33.34 33.34,31.54 R4.1
  Bottom 0.406: v8.26,37.15 9.53,35.88 19.05,35.88 23.81,31.43 23.81,27.94 v25.08,26.67 30.16,26.67 33.34,29.84 v33.34,33.34 29.53,37.15 v29.53,37.78
TX-AUDIO
  Top 0.406: R13.1 C3.2
TXD
  Top 0.406: U7.31 28.16,30.89 J3.2
V+  (via drill 0.6)
  Top 0.406: R16.2 44.52,6.67 D3.C | C7.1 5.08,9.84 7.3,12.06 v9.84,12.06
  Top 1.016: D3.C v39.37,3.81 | U3.3 v9.84,12.06
  Bottom 1.016: v39.37,3.81 15.24,3.81 9.84,9.21 v9.84,12.06
XCEIVER-RX  (2 unrouted)
XCEIVER-TX  (2 unrouted)

### Text on the board
tNames: VHF Xmit | Project: Traveler ptFlex v2.00 / Custom Digital Services, LLC / www.custom-ds.com | GPS Antenna | THIS / SIDE UP | PTT | Status | Qwiic | GND / 3.3 / SDA / SCL | GND / TX / RX | ICSP | Reset | 6.5-14V DC